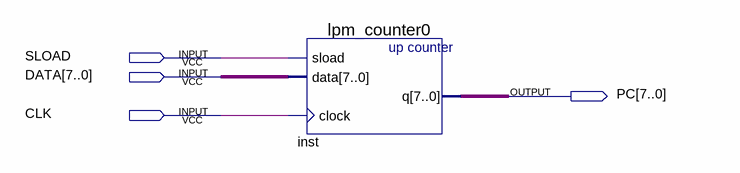
[diagram p0: schematic sheet]
// Quartus schematic PC.bdf as structural Verilog: 1 symbols, 4 pins
module PC (
  input  SLOAD,
  input  [7:0] DATA,
  input  CLK,
  output [7:0] PC
);

  lpm_counter0 inst (.sload(SLOAD), .data(DATA), .clock(CLK), .q(PC));
endmodule
